# EAGLE design Noboru (EAGLE 5.06)
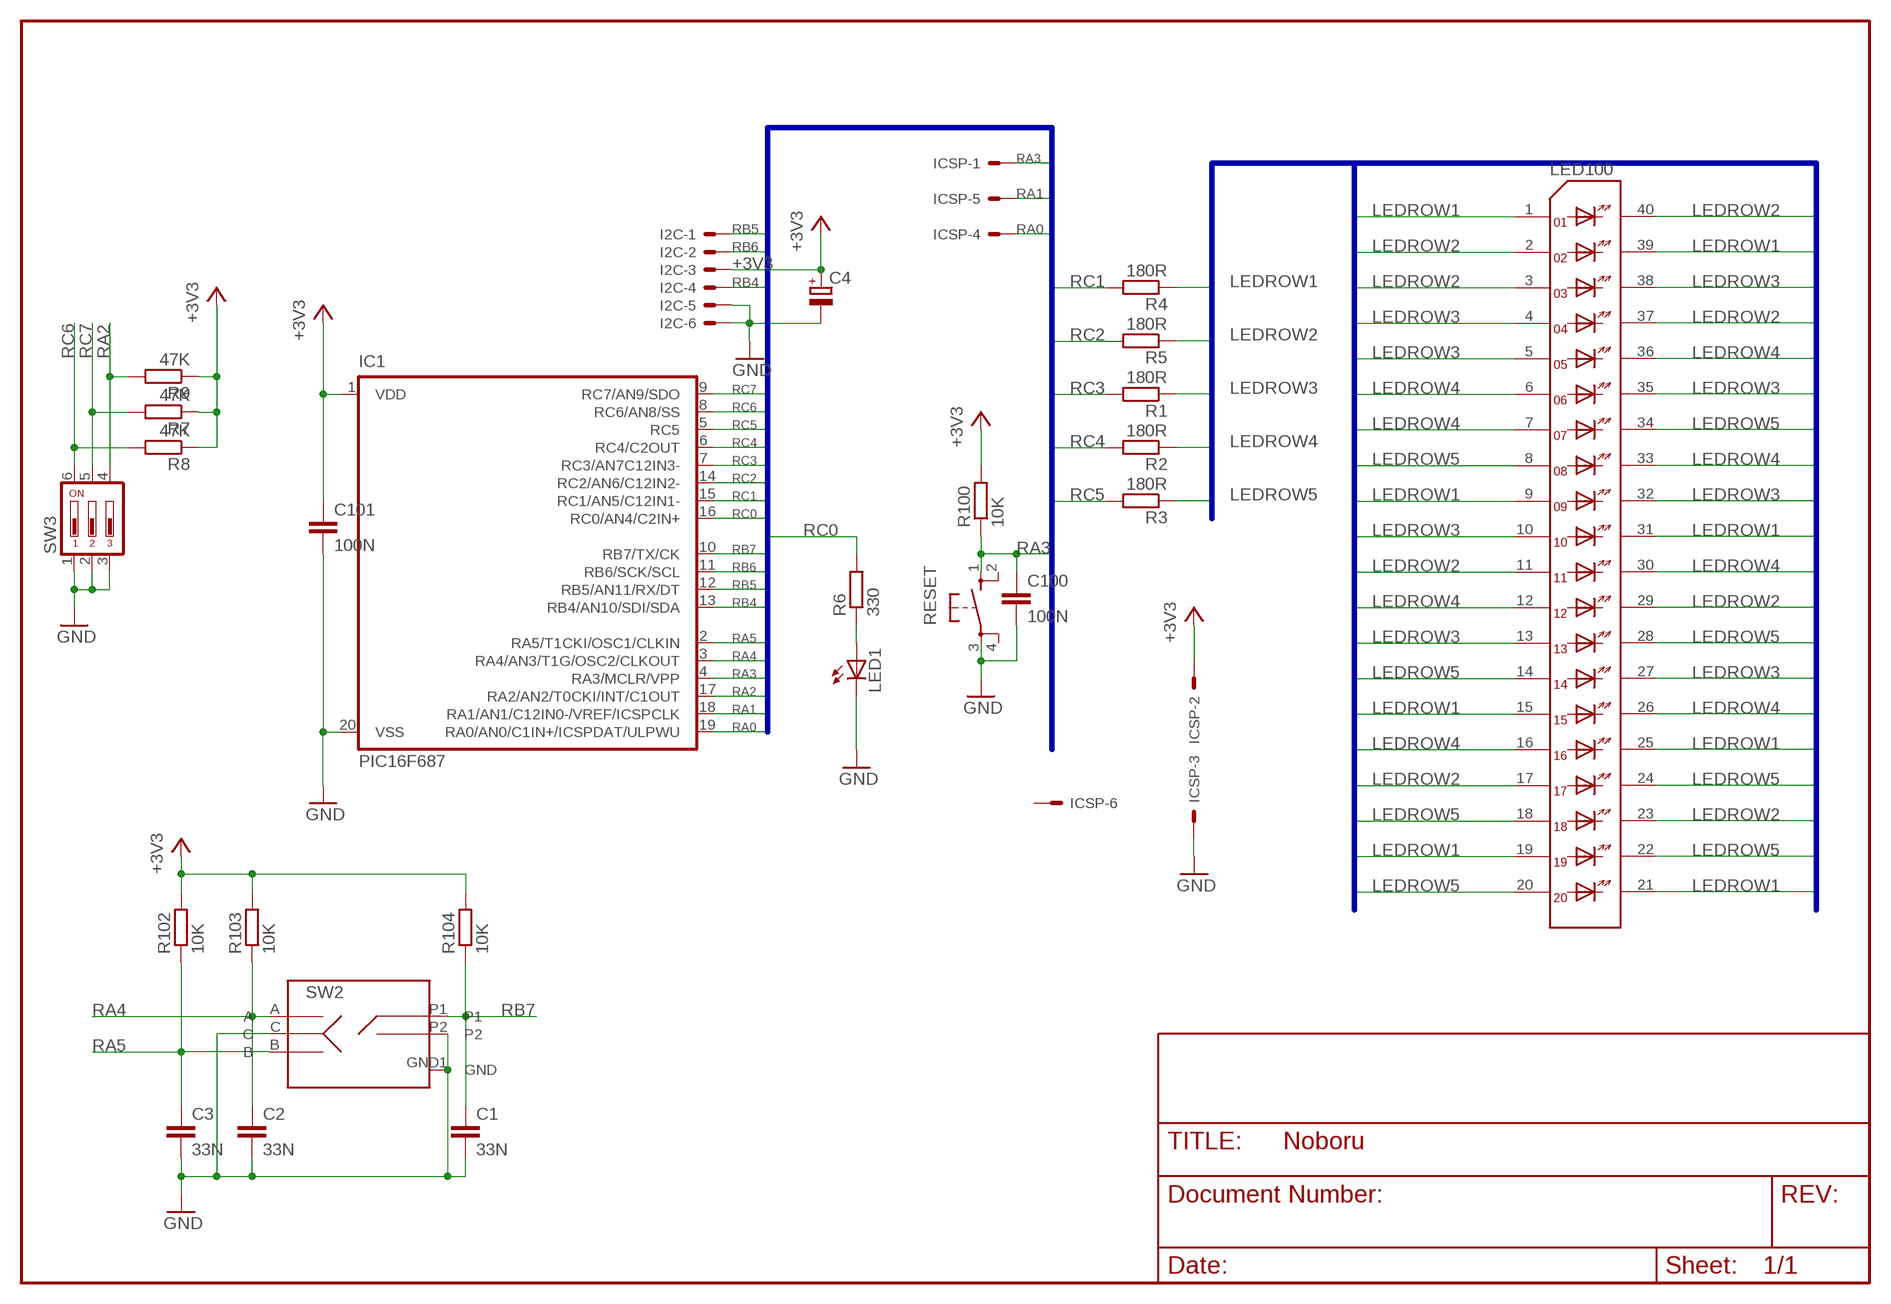
[diagram p0: schematic, sheet 1]

## Parts
C1  33N  C-EUC0805  [C0805]
C2  33N  C-EUC0805  [C0805]
C3  33N  C-EUC0805  [C0805]
C4  CPOL-EUE3.5-10  [E3,5-10]
C100  100N  C-EUC0805  [C0805]
C101  100N  C-EUC0805  [C0805]
I2C  22-23-2061  [22-23-2061]
IC1  PIC16F687  [SSOP20]
ICSP  22-23-2061  [22-23-2061]
LED1  LEDCHIP-LED0805  [CHIP-LED0805]
LED100  KINGBRIGHT_ROW_20  [KINGBRIGHT_ROW_20]
R1  180R  R-EU_M0805  [M0805]
R2  180R  R-EU_M0805  [M0805]
R3  180R  R-EU_M0805  [M0805]
R4  180R  R-EU_M0805  [M0805]
R5  180R  R-EU_M0805  [M0805]
R6  330  R-EU_M0805  [M0805]
R7  47K  R-EU_M0805  [M0805]
R8  47K  R-EU_M0805  [M0805]
R9  47K  R-EU_M0805  [M0805]
R100  10K  R-EU_M0805  [M0805]
R102  10K  R-EU_M0805  [M0805]
R103  10K  R-EU_M0805  [M0805]
R104  10K  R-EU_M0805  [M0805]
RESET  10XX  [B3F-10XX]
SW2  DDM_427  [DDM427]
SW3  DS03  [DS-03]

## Nets
+3V3: C4.+ C101.1 I2C.3 IC1.1(VDD) ICSP.2 R7.1 R8.1 R9.1 R100.2 R102.2 R103.2 R104.2
GND: C1.2 C2.2 C3.2 C4.- C100.2 C101.2 I2C.5 I2C.6 IC1.20(VSS) ICSP.3 LED1.C RESET.3 SW2.C SW2.GND1(GND) SW2.P2 SW3.1 SW3.2 SW3.3
LEDROW1: LED100.1 LED100.9 LED100.15 LED100.19 LED100.21 LED100.25 LED100.31 LED100.39 R4.1
LEDROW2: LED100.2 LED100.3 LED100.11 LED100.17 LED100.23 LED100.29 LED100.37 LED100.40 R5.1
LEDROW3: LED100.4 LED100.5 LED100.10 LED100.13 LED100.27 LED100.32 LED100.35 LED100.38 R1.1
LEDROW4: LED100.6 LED100.7 LED100.12 LED100.16 LED100.26 LED100.30 LED100.33 LED100.36 R2.1
LEDROW5: LED100.8 LED100.14 LED100.18 LED100.20 LED100.22 LED100.24 LED100.28 LED100.34 R3.1
N$1: LED1.A R6.1
RA0: IC1.19(RA0/AN0/C1IN+/ICSPDAT/ULPWU) ICSP.4
RA1: IC1.18(RA1/AN1/C12IN0-/VREF/ICSPCLK) ICSP.5
RA2: IC1.17(RA2/AN2/T0CKI/INT/C1OUT) R9.2 SW3.4
RA3: C100.1 IC1.4(RA3/MCLR/VPP) ICSP.1 R100.1 RESET.1
RA4: C2.1 IC1.3(RA4/AN3/T1G/OSC2/CLKOUT) R103.1 SW2.A
RA5: C3.1 IC1.2(RA5/T1CKI/OSC1/CLKIN) R102.1 SW2.B
RB4: I2C.4 IC1.13(RB4/AN10/SDI/SDA)
RB5: I2C.1 IC1.12(RB5/AN11/RX/DT)
RB6: I2C.2 IC1.11(RB6/SCK/SCL)
RB7: C1.1 IC1.10(RB7/TX/CK) R104.1 SW2.P1
RC0: IC1.16(RC0/AN4/C2IN+) R6.2
RC1: IC1.15(RC1/AN5/C12IN1-) R4.2
RC2: IC1.14(RC2/AN6/C12IN2-) R5.2
RC3: IC1.7(RC3/AN7C12IN3-) R1.2
RC4: IC1.6(RC4/C2OUT) R2.2
RC5: IC1.5(RC5) R3.2
RC6: IC1.8(RC6/AN8/SS) R8.2 SW3.6
RC7: IC1.9(RC7/AN9/SDO) R7.2 SW3.5
Unconnected: ICSP.6 RESET.2 RESET.4

## Buses
RA[0..5],RB[4..7],RC[0..7]
LEDROW[1..5]

## Library data of the parts
C1-C3 C100 C101 = turbod3:C-EU: CAPACITOR, European symbol
C4 = rcl:CPOL-EU: POLARIZED CAPACITOR, European symbol
I2C ICSP = con-molex:22-23-2061: .100" (2.54mm) Center Header - 6 Pin
IC1 = microchip-5:PIC16F687*: MICROCONTROLLER PIC16F687 18 I/O One 16-bit timer One 8-bit timer Two comparators Precision internal oscillator-software selectable 8 MHz - 32 KHz SSP w/ I2C Compatible Address mask option EUSART LIN 2.0 Compatible 12 A/D Channels ULPW Enhanced Low Power Timer 1 Timer 1 Gate Synch Latch 2k Program Flash memory 128 bytes SRAM 256 bytes EEPROM
LED1 = led:LED: LED OSRAM: - CHIPLED LG R971, LG N971, LY N971, LG Q971, LY Q971, LO R971, LY R971 LH N974, LH R974 LS Q976, LO Q976, LY Q976 LO Q996 - Hyper CHIPLED LW Q18S LB Q993, LB Q99A, LB R99A - SideLED LS A670, LO A670, LY A670, LG A670, LP A670 LB A673, LV A673, LT A673, LW A673 LH A674 LY A675 LS A676, LA A676, LO A676, LY A676, LW A676 LS A679, LY A679, LG A679 - Hyper Micro SIDELED® LS Y876, LA Y876, LO Y876, LY Y876 LT Y87S - SmartLED LW L88C, LW L88S LB L89C, LB L89S, LG L890 LS L89K, LO L89K, LY L89K LS L896, LA L896, LO L896, LY L896 - TOPLED LS T670, LO T670, LY T670, LG T670, LP T670 LSG T670, LSP T670, LSY T670, LOP T670, LYG T670 LG T671, LOG T671, LSG T671 LB T673, LV T673, LT T673, LW T673 LH T674 LS T676, LA T676, LO T676, LY T676, LB T676, LH T676, LSB T676, LW T676 LB T67C, LV T67C, LT T67C, LS T67K, LO T67K, LY T67K, LW E67C LS E67B, LA E67B, LO E67B, LY E67B, LB E67C, LV E67C, LT E67C LW T67C LS T679, LY T679, LG T679 LS T770, LO T770, LY T770, LG T770, LP T770 LB T773, LV T773, LT T773, LW T773 LH T774 LS E675, LA E675, LY E675, LS T675 LS T776, LA T776, LO T776, LY T776, LB T776 LHGB T686 LT T68C, LB T68C - Hyper Mini TOPLED® LB M676 - Mini TOPLED Santana® LG M470 LS M47K, LO M47K, LY M47K Source: http://www.osram.convergy.de - LUMILED® LXK2-PW12-R00, LXK2-PW12-S00, LXK2-PW14-U00, LXK2-PW14-V00 LXK2-PM12-R00, LXK2-PM12-S00, LXK2-PM14-U00 LXK2-PE12-Q00, LXK2-PE12-R00, LXK2-PE12-S00, LXK2-PE14-T00, LXK2-PE14-U00 LXK2-PB12-K00, LXK2-PB12-L00, LXK2-PB12-M00, LXK2-PB14-N00, LXK2-PB14-P00, LXK2-PB14-Q00 LXK2-PR12-L00, LXK2-PR12-M00, LXK2-PR14-Q00, LXK2-PR14-R00 LXK2-PD12-Q00, LXK2-PD12-R00, LXK2-PD12-S00 LXK2-PH12-R00, LXK2-PH12-S00 LXK2-PL12-P00, LXK2-PL12-Q00, LXK2-PL12-R00 Source: www.luxeon.com
LED100 = turbod3:KINGBRIGHT_ROW_20
R1-R9 R100 R102-R104 = turbod3:R-EU_: RESISTOR, European symbol
RESET = KEY_B:10XX
SW2 = turbod3:DDM_427
SW3 = switch-dil:DS03: DIL/CODE SWITCH

## Board
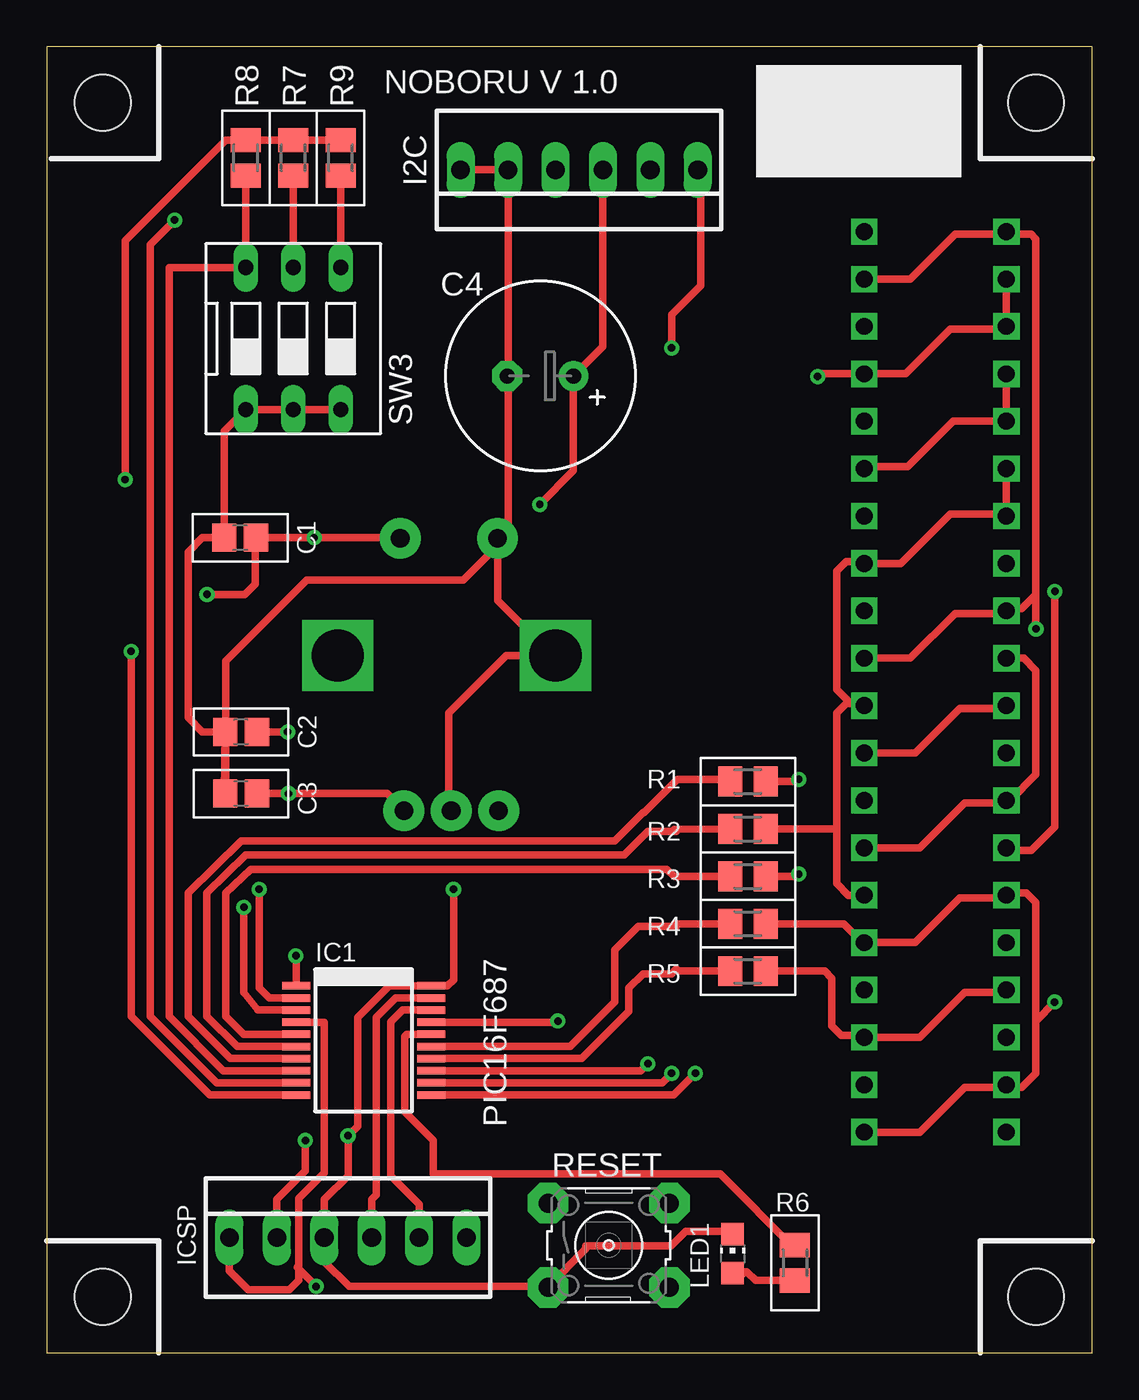
[diagram p1: board, top side]
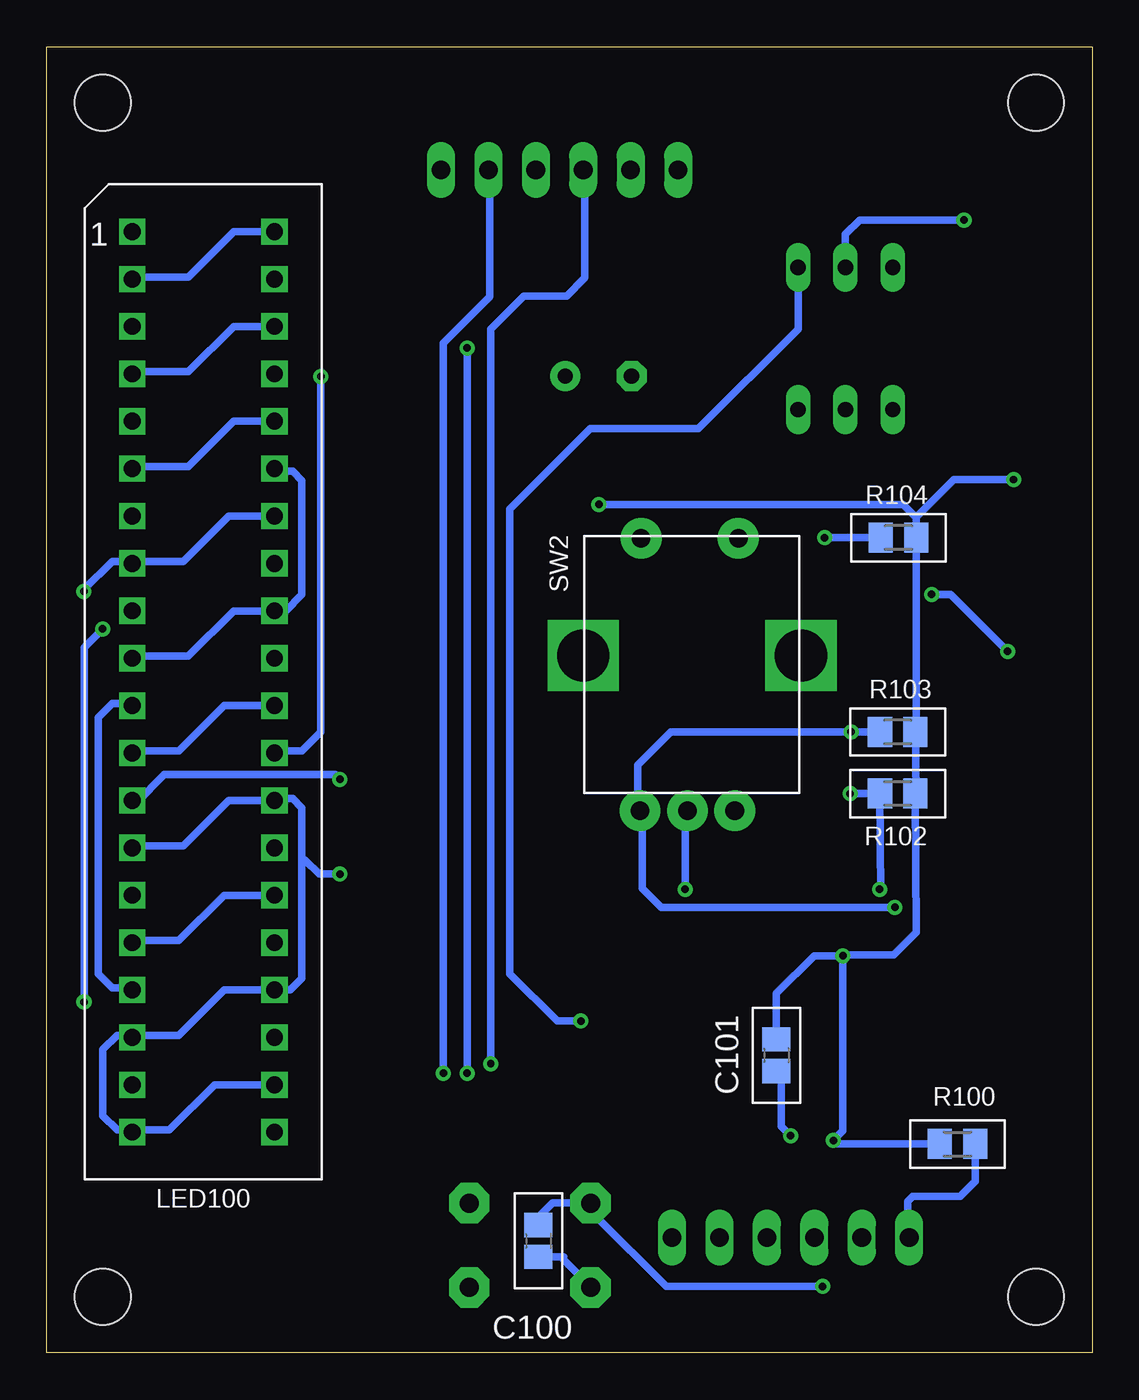
[diagram p2: board, bottom side, seen from below]

Size 56 x 70 mm. Coordinates in mm from the lower left corner, seen from the top.
Outline: 0,0 56,0 56,70 0,70 0,0
Copper layers (1*16): Top 0.035mm / dielectric 1.5mm / Bottom 0.035mm
Design rules "pcbcart-1 *": minimum track width 10mil, minimum drill 0.4mm, track to track 8mil, track to pad 8mil, pad to pad 8mil, via to via 8mil, smd to smd 8mil, copper to edge 40mil, drill to drill 0.3mm, minimum pad ring 10mil, minimum via ring 8mil, stop-mask expansion 0mil, vias tented up to drill 0mil, thermal gap 10mil
Holes 3 mm at 3,67 3,3 53,67 53,3

### Footprints (pad centres in the part's own frame; a part is rotated, then mirrored left to right if it is on the bottom)
C0805 = smd 1.3 x 1.5: 1 -0.85,0; 2 0.85,0
E3,5-10 = drill 0.813 pad 1.6 round: + -1.778,0 | drill 0.813 pad 1.6 octagon: - 1.778,0
22-23-2061 = drill 1 long: 1 -6.35,0; 2 -3.81,0; 3 -1.27,0; 4 1.27,0; 5 3.81,0; 6 6.35,0
SSOP20 = smd 0.4 x 1.5: 1 -2.925,-3.625; 2 -2.275,-3.625; 3 -1.625,-3.625; 4 -0.975,-3.625; 5 -0.325,-3.625; 6 0.325,-3.625; 7 0.975,-3.625; 8 1.625,-3.625; 9 2.275,-3.625; 10 2.925,-3.625; 11 2.925,3.625; 12 2.275,3.625; 13 1.625,3.625; 14 0.975,3.625; 15 0.325,3.625; 16 -0.325,3.625; 17 -0.975,3.625; 18 -1.625,3.625; 19 -2.275,3.625; 20 -2.925,3.625
CHIP-LED0805 = smd 1.2 x 1.2: A 0,-1.05; C 0,1.05
KINGBRIGHT_ROW_20 = drill 0.9 square: 1 -2.54,22.86; 2 -2.54,20.32; 3 -2.54,17.78; 4 -2.54,15.24; 5 -2.54,12.7; 6 -2.54,10.16; 7 -2.54,7.62; 8 -2.54,5.08; 9 -2.54,2.54; 10 -2.54,0; 11 -2.54,-2.54; 12 -2.54,-5.08; 13 -2.54,-7.62; 14 -2.54,-10.16; 15 -2.54,-12.7; 16 -2.54,-15.24; 17 -2.54,-17.78; 18 -2.54,-20.32; 19 -2.54,-22.86; 20 -2.54,-25.4; 21 5.08,-25.4; 22 5.08,-22.86; 23 5.08,-20.32; 24 5.08,-17.78; 25 5.08,-15.24; 26 5.08,-12.7; 27 5.08,-10.16; 28 5.08,-7.62; 29 5.08,-5.08; 30 5.08,-2.54; 31 5.08,0; 32 5.08,2.54; 33 5.08,5.08; 34 5.08,7.62; 35 5.08,10.16; 36 5.08,12.7; 37 5.08,15.24; 38 5.08,17.78; 39 5.08,20.32; 40 5.08,22.86
M0805 = smd 1.3 x 1.6: 1 -0.95,0; 2 0.95,0
B3F-10XX = drill 1.016 pad 2.159 octagon: 1 -3.379,2.312; 2 3.123,2.312; 3 -3.379,-2.209; 4 3.123,-2.209
DDM427 = drill 1 pad 2.184 round: A 2.98,-0.96; B 8.06,-0.96; C 5.52,-0.96; P1 8.25,13.64; P2 3.04,13.64 | drill 2.8 pad 3.81 square: GND1 -0.06,7.35; GND2 11.6,7.35
DS-03 = drill 0.813 long: 1 -2.54,-3.81; 2 0,-3.81; 3 2.54,-3.81; 4 2.54,3.81; 5 0,3.81; 6 -2.54,3.81

### Placement (x,y rotation side)
C1  10.37,43.69 180 top
C2  10.41,33.27 180 top
C3  10.41,29.97 180 top
C4  26.44,52.35 180 top
C100  29.65,6 270 bottom
C101  16.91,15.95 270 bottom
I2C  28.53,63.4 180 top
IC1  16.98,16.75 270 top
ICSP  16.14,6.19 0 top
LED1  36.75,5.32 0 top
LED100  48.87,37.23 0 bottom
R1  37.57,30.62 180 top
R2  37.57,28.08 180 top
R3  37.57,25.54 180 top
R4  37.57,23 180 top
R5  37.57,20.46 180 top
R6  40.08,4.83 90 top
R7  13.21,64.04 270 top
R8  10.67,64.04 270 top
R9  15.75,64.04 270 top
R100  7.2,11.19 180 bottom
R102  10.41,29.97 0 bottom
R103  10.41,33.27 0 bottom
R104  10.37,43.69 0 bottom
RESET  30.24,5.71 0 top
SW2  27.19,30.02 0 bottom
SW3  13.21,54.36 0 top

### Tracks (layer width: path | path; a pad name or v marks a point on that pad's centre or on a via)
+3V3  (via drill 0.4)
  Top 0.406: IC1.1 v13.36,21.27 v13.35,21.28 | v13.86,11.38 13.86,9.74 12.33,8.22 ICSP.2 | C4.+ 28.19,52.32 | C4.+ 28.22,47.27 v26.42,45.47 | I2C.3 29.8,53.93 C4.+ | R8.1 13.14,64.99 13.21,65.06 R7.1 15.43,64.99 15.49,65.06 15.56,64.99 R9.1 9.59,64.99 4.2,59.6 v4.2,46.8
  Bottom 0.406: C101.1 16.91,19.25 14.87,21.28 v13.35,21.28 | v13.35,21.28 13.35,11.89 v13.86,11.38 v13.87,11.38 | v13.87,11.38 13.92,11.43 | R100.2 13.68,11.19 v13.87,11.38 | 9.42,44.77 R104.2 9.42,33.24 | 9.42,44.77 10.11,45.47 v26.42,45.47 | v13.35,21.28 13.36,21.28 13.41,21.34 10.62,21.34 9.42,22.54 R102.2 9.35,29.97 9.42,30.04 R103.2 9.42,33.24 | 9.42,33.24 9.4,33.22 | 9.42,44.77 9.42,44.78 7.4,46.8 v4.2,46.8
GND  (via drill 0.4)
  Top 0.406: IC1.20 18.34,19.67 16.65,17.98 16.65,12.14 v16.14,11.63 16.14,9.49 14.87,8.22 ICSP.3 14.87,4.89 16.21,3.56 26.88,3.56 26.86,3.54 RESET.3 26.86,3.54 28.89,5.57 28.89,5.75 33.46,5.75 34.23,6.51 36.65,6.51 36.79,6.37 | 36.77,6 36.77,6.35 LED1.C | 36.77,6.51 36.75,6.49 LED1.C | 36.7,6.31 LED1.C | 36.79,6.37 36.8,6.36 | 36.79,6.37 LED1.C | I2C.6 I2C.5 24.72,52.32 | SW2.P2 24.3,43.66 24.72,44.07 24.72,52.32 | SW2.P2 24.15,40.31 27.13,37.34 27.16,37.37 SW2.GND1 24.62,37.37 21.54,34.29 21.54,29.21 21.7,29.06 | 9.6,29.97 C3.2 | C2.2 9.52,30.06 9.6,29.97 | C2.2 9.6,33.27 | C2.2 8.33,33.27 7.57,34.04 7.57,42.93 8.33,43.69 C1.2 9.52,49.39 SW3.1 SW3.2 SW3.3 | IC1.20 20.39,19.67 | 21.7,29.06 21.8,28.96 | SW2.C 21.7,29.06 | 9.6,29.97 9.6,37.08 13.92,41.4 22.3,41.4 24.34,43.43 24.15,43.62 SW2.P2 | 20.54,19.67 20.53,19.68 | IC1.20 20.54,19.67 | 20.54,19.67 20.55,19.66 21.47,19.66 21.8,19.99 v21.8,24.84 21.8,24.43 | 24.72,52.32 24.71,52.32 | 24.71,52.32 24.71,51.56 | 24.71,52.4 24.71,52.43 | 24.71,52.4 C4.- | 24.71,52.32 24.71,52.4
  Bottom 0.406: C100.2 28.3,5.15 28.3,4.97 26.86,3.54 RESET.3 | v16.14,11.63 16.65,12.14 16.65,14.68 16.91,14.93 C101.2 | 21.67,29.08 21.54,29.21 | 21.67,29.08 SW2.C | v21.8,24.84 21.8,28.96 21.67,29.08
LEDROW1  (via drill 0.4)
  Top 0.406: LED100.39 46.27,57.55 48.67,59.94 51.47,59.94 | 51.47,59.94 51.41,60 LED100.1 | LED100.31 46.27,37.23 48.67,39.62 51.21,39.62 51.35,39.77 LED100.9 51.32,39.77 51.21,39.88 52.23,39.88 52.99,40.64 52.99,40.89 | 51.47,24.64 51.41,24.59 | 51.41,24.59 LED100.15 51.32,24.53 51.21,24.64 51.47,24.64 | 51.41,24.59 51.21,24.38 | LED100.21 46.78,11.83 49.18,14.22 | LED100.19 51.41,14.28 51.47,14.22 49.18,14.22 | 49.18,14.22 52.23,14.22 52.99,14.99 52.99,17.8 | 52.99,17.8 52.99,24.13 52.48,24.64 51.47,24.64 | 51.47,59.94 52.74,59.94 52.99,59.69 52.99,40.89 | 43.79,21.9 43.85,21.84 | 43.79,21.9 LED100.25 46.53,21.99 48.93,24.38 51.21,24.38 | R4.1 42.69,23 43.79,21.9 | 51.47,24.64 51.21,24.38 | 52.99,40.89 v52.99,38.81 v53,38.8 | 52.99,17.8 53,17.8 v54,18.8
  Bottom 0.406: v53,38.8 54,37.8 v54,18.8
LEDROW2  (via drill 0.4)
  Top 0.406: 46.02,52.47 LED100.37 | 46.02,52.47 48.42,54.86 51.21,54.86 51.41,55.07 | LED100.29 46.53,32.15 48.93,34.54 51.47,34.54 51.41,34.6 LED100.11 | 51.41,55.07 51.47,55.12 51.41,55.17 LED100.2 | 51.41,55.07 LED100.3 | 46.02,52.47 41.45,52.47 v41.31,52.32 | R5.1 41.68,20.46 42.07,20.07 42.07,17.53 42.58,17.02 43.85,17.02 43.96,16.91 | 43.96,16.91 44.1,16.76 | 43.96,16.91 LED100.23 46.78,16.91 49.18,19.3 51.31,19.3 51.46,19.45 | 51.46,19.45 51.49,19.48 | 51.46,19.45 LED100.17
  Bottom 0.406: LED100.40 45.99,60.09 48.42,57.66 51.47,57.66 51.41,57.61 LED100.2 | LED100.11 51.32,34.69 51.21,34.8 52.48,34.8 53.24,34.04 53.24,20.32 52.48,19.56 51.54,19.56 51.43,19.45 LED100.17 | v41.31,52.32 41.31,33.27 42.32,32.26 44.1,32.26 43.99,32.15 LED100.29
LEDROW3  (via drill 0.4)
  Top 0.406: LED100.35 43.7,47.39 43.59,47.5 46.13,47.5 48.56,49.93 LED100.5 51.41,49.84 | LED100.27 46.78,27.07 49.18,29.46 51.21,29.46 51.35,29.61 LED100.13 51.61,29.61 52.99,30.99 52.99,36.58 52.34,37.23 LED100.10 | 51.41,49.84 LED100.4 | 51.41,49.84 51.47,49.78 | R1.1 40.17,30.62 v40.29,30.73
  Bottom 0.406: LED100.38 45.99,55.01 48.42,52.58 51.47,52.58 51.41,52.53 LED100.4 | LED100.10 51.41,37.29 51.47,37.34 48.42,37.34 45.99,39.77 LED100.32 43.2,39.77 42.32,40.64 42.32,46.74 42.83,47.24 43.85,47.24 43.79,47.3 LED100.35 | v40.29,30.73 40.54,30.99 49.69,30.99 51.21,29.46 51.35,29.61 LED100.13
LEDROW4
  Top 0.406: 51.41,44.76 LED100.7 51.41,44.91 51.47,44.96 48.42,44.96 45.77,42.31 LED100.33 43.79,42.37 43.85,42.42 42.83,42.42 42.32,41.91 42.32,35.56 43.08,34.8 43.85,34.8 | 51.41,44.76 LED100.6 | 51.41,44.76 51.47,44.7 | 42.32,27.94 42.32,25.15 42.94,24.53 43.76,24.53 43.77,24.54 LED100.26 | 42.32,27.94 42.32,34.29 42.83,34.8 43.85,34.8 | 43.85,34.8 43.79,34.75 LED100.30 | R2.1 42.19,28.08 42.32,27.94
  Bottom 0.406: LED100.36 45.99,49.93 48.42,47.5 51.47,47.5 51.41,47.45 LED100.6 | LED100.30 46.5,34.69 48.93,32.26 51.21,32.26 51.41,32.06 | 51.41,32.06 51.47,32 | 51.41,32.06 LED100.12 | LED100.16 51.61,21.99 51.72,22.1 48.93,22.1 46.5,24.53 43.89,24.53 43.85,24.49 43.81,24.53 LED100.26
LEDROW5  (via drill 0.4)
  Top 0.406: v54.01,40.81 54.01,28.19 52.74,26.92 51.21,26.92 51.35,27.07 LED100.14 | R3.1 40.17,25.54 v40.29,25.65
  Bottom 0.406: LED100.34 46.24,44.85 48.67,42.42 51.47,42.42 | 51.47,42.42 51.41,42.37 LED100.8 | 51.41,26.98 51.47,26.92 | 51.41,26.98 LED100.14 | 51.41,26.98 51.21,27.18 48.67,27.18 46.24,29.61 LED100.28 43.79,29.67 43.85,29.72 42.83,29.72 42.32,29.21 42.32,26.42 | 46.5,19.45 LED100.24 | 48.93,17.02 46.5,19.45 | 51.58,16.91 51.72,16.76 | 51.58,16.91 LED100.18 | 48.93,17.02 51.47,17.02 51.58,16.91 | LED100.22 47.01,14.37 49.43,11.94 51.47,11.94 | 51.47,11.94 51.72,11.94 51.61,11.83 LED100.20 51.41,11.89 51.47,11.94 | 48.93,17.02 52.23,17.02 52.99,16.26 52.99,12.7 52.23,11.94 51.47,11.94 | 46.5,19.45 42.94,19.45 42.32,20.07 42.32,26.42 | 51.47,42.42 52.48,42.42 54.01,40.89 v54.01,40.81 | 42.32,26.42 42.16,26.42 41.4,25.65 v40.29,25.65
N$1
  Top 0.406: 37.07,4.02 37.02,3.97 | LED1.A 37.07,4.02 | 37.07,4.02 37.41,4.36 37.51,4.36 37.99,3.88 R6.1
RA0
  Top 0.406: IC1.19 18.71,19.02 17.67,17.98 17.67,8.47 17.41,8.22 ICSP.4 17.41,5.93
RA1
  Top 0.406: IC1.18 19.07,18.37 18.43,17.73 18.43,9.49 19.95,7.96 ICSP.5 19.95,5.93
RA2  (via drill 0.4)
  Top 0.406: IC1.17 27.32,17.72 v27.38,17.78 | SW3.4 R9.2
  Bottom 0.406: v27.38,17.78 28.65,17.78 31.19,20.32 31.19,45.21 26.88,49.53 21.08,49.53 15.75,54.86 15.75,57.91 15.49,58.17 SW3.4
RA3  (via drill 0.4)
  Top 0.406: IC1.4 14.88,17.72 14.88,17.52 | 14.88,17.52 14.87,17.47 | ICSP.1 9.79,4.41 10.81,3.39 12.99,3.39 13.5,3.9 13.5,4.57 | 13.5,4.57 13.5,8.27 14.87,9.64 14.87,17.52 14.88,17.52 | 13.5,4.57 13.41,4.57 v14.43,3.56
  Bottom 0.406: C100.1 29.65,7.27 28.89,8.03 26.61,8.03 | 26.61,8.03 RESET.1 | R100.1 6.25,9.19 7.06,8.38 9.6,8.38 9.86,8.13 9.86,6.1 9.79,6.16 ICSP.1 | 26.61,8.03 26.61,7.35 22.81,3.56 v14.43,3.56
RA4  (via drill 0.4)
  Top 0.406: IC1.3 11.3,18.37 10.57,19.3 v10.57,23.88 | v12.91,33.27 C2.1
  Bottom 0.406: 24.08,29.21 24.34,29.46 | v10.57,23.88 23.07,23.88 24.08,24.89 24.08,28.96 | 24.08,29.21 24.21,29.08 SW2.A 24.18,29.06 24.08,28.96 | 24.08,28.96 24.08,29.21 | v12.91,33.27 R103.1 22.56,33.27 24.34,31.5 24.34,29.21 24.08,28.96
RA5  (via drill 0.4)
  Top 0.406: 13.6,19 13.58,19.02 IC1.2 11.92,19.02 11.38,19.56 v11.38,24.84 | SW2.B 19.13,29.08 18.24,29.97 v12.95,29.97 C3.1
  Bottom 0.406: v11.38,24.84 11.33,24.64 11.32,24.65 R102.1 | R102.1 11.38,29.95 | R102.1 v12.95,29.97
RB4  (via drill 0.4)
  Top 0.406: IC1.13 31.84,15.12 v32.21,15.49
  Bottom 0.406: v32.21,15.49 32.21,54.86 30.43,56.64 28.15,56.64 27.18,57.61 27.18,63.48 | 27.18,63.48 27.18,63.5 | 27.18,63.48 I2C.4
RB5  (via drill 0.4)
  Top 0.406: IC1.12 32.97,14.47 v33.48,14.99 | v33.48,53.85 33.48,55.63 35.05,57.2 35.05,63.5 34.98,63.5 I2C.1
  Bottom 0.406: v33.48,14.99 v33.48,53.85
RB6  (via drill 0.4)
  Top 0.406: IC1.11 33.59,13.82 v34.75,14.99
  Bottom 0.406: v34.75,14.99 34.75,54.1 32.26,56.59 32.26,63.48 | 32.26,63.48 32.26,63.5 | 32.26,63.48 I2C.2
RB7  (via drill 0.4)
  Top 0.406: 11.22,43.67 11.18,43.64 11.18,41.2 10.62,40.64 v8.59,40.64 | 11.22,43.67 C1.1 | 11.22,43.67 C1.1 v14.33,43.69 18.85,43.69 18.9,43.74 18.94,43.7 SW2.P1 | IC1.10 8.74,13.82 4.52,18.03 v4.52,37.59
  Bottom 0.406: v14.33,43.69 R104.1 | v8.59,40.64 7.57,40.64 v4.52,37.59
RC0
  Top 0.406: IC1.16 19.3,17.07 19.19,16.97 19.19,12.9 20.72,11.38 20.72,9.6 36.07,9.6 40.08,5.59 R6.2
RC1
  Top 0.406: IC1.15 28.06,16.42 30.43,18.8 30.43,21.59 31.7,22.86 33.73,22.86 33.62,22.97 R4.2
RC2
  Top 0.406: IC1.14 28.68,15.77 31.19,18.29 31.19,19.56 31.96,20.32 33.48,20.32 33.62,20.46 | 33.62,20.46 33.73,20.57 | 33.62,20.46 R5.2
RC3
  Top 0.406: IC1.7 9.84,15.77 7.57,18.03 7.57,24.64 10.41,27.43 30.43,27.43 31.96,28.96 32,28.96 33.78,30.73 36.83,30.73 36.71,30.62 R1.2
RC4
  Top 0.406: IC1.6 10.2,16.42 8.59,18.03 8.59,24.64 10.67,26.67 30.94,26.67 32.21,27.94 33.73,27.94 33.62,28.05 R2.2
RC5
  Top 0.406: IC1.5 10.57,17.07 9.6,18.03 9.6,24.64 10.92,25.91 33.23,25.91 33.62,25.54 R3.2
RC6
  Top 0.406: IC1.8 9.47,15.12 6.56,18.03 6.56,58.17 10.41,58.17 10.67,58.42 SW3.6 R8.2
RC7  (via drill 0.4)
  Top 0.406: IC1.9 9.1,14.47 5.54,18.03 5.54,59.39 v6.86,60.71 | SW3.5 12.95,58.17 13.21,58.42 R7.2
  Bottom 0.406: v6.86,60.71 12.45,60.71 13.21,59.94 SW3.5 13.21,57.91

### Text on the board
tNames: NOBORU V 1.0 | PIC16F687